# Altium schematic sheet Schema.SchDoc: SensorBoard_Schema
size A4; Date: 04.03.2021; Author: bweina; CompanyName: ICT Bbc AG; DrawnBy: bweina; Engineer: bweina; Organization: ICT Bbc AG; Revision: 1.1.0; SheetNumber: 1; SheetTotal: 1; Time: 13:55
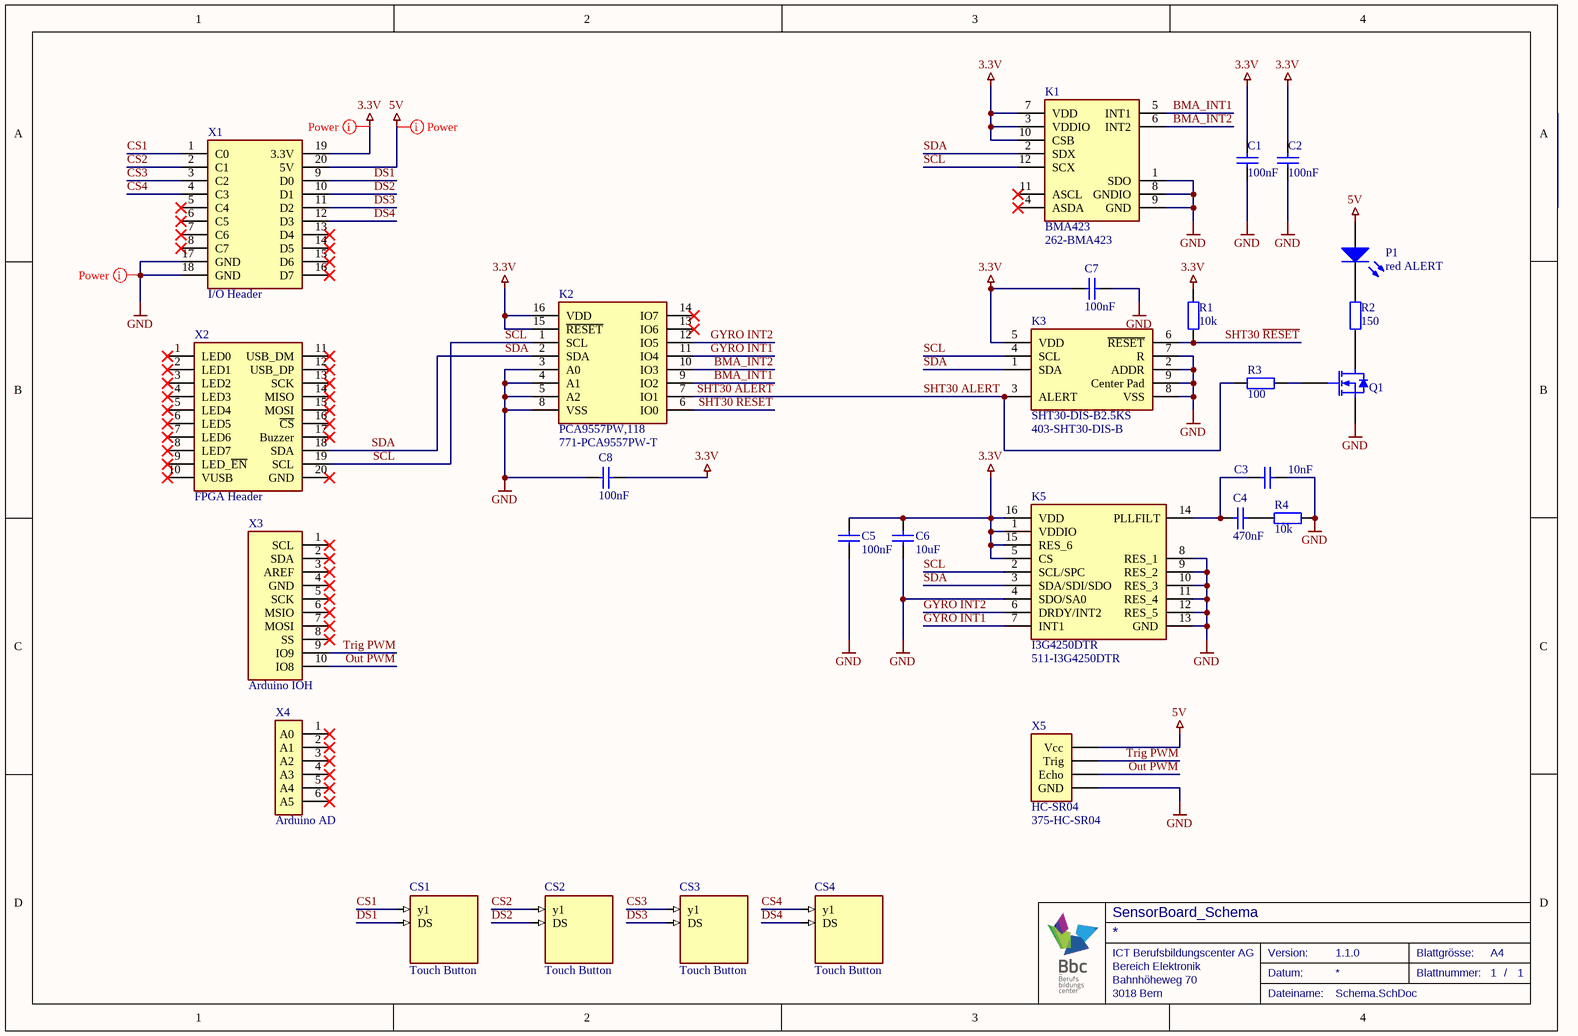
[diagram p0: Schema.SchDoc]

## Parts
C1  value 100nF  [CAP CER 0805 H]  (hidden comment: Capacitor)
C2  value 100nF  [CAP CER 0805 H]  (hidden comment: Capacitor)
C3  value 10nF  [CAP CER 0805 H]  (hidden comment: Capacitor)
C4  value 470nF  [CAP CER 0805 H]  (hidden comment: Capacitor)
C5  value 100nF  [CAP CER 0805 H]  (hidden comment: Capacitor)
C6  value 10uF  [CAP CER 0805 H]  (hidden comment: Capacitor)
C7  value 100nF  [CAP CER 0805 H]  (hidden comment: Capacitor)
C8  value 100nF  [CAP CER 0805 H]  (hidden comment: Capacitor)
CS1  Touch Button  [Button Self Rectangle]
CS2  Touch Button  [Button Self Rectangle]
CS3  Touch Button  [Button Self Rectangle]
CS4  Touch Button  [Button Self Rectangle]
K1  BMA423  Supplier Part Number 1: 262-BMA423  [BMA423]
K2  PCA9557PW,118  Supplier Part Number 1: 771-PCA9557PW-T  [SOP65P640X110-16N]
K3  SHT30-DIS-B2.5KS  Supplier Part Number 1: 403-SHT30-DIS-B  [SHT30DISB25KS]
K5  I3G4250DTR  Supplier Part Number 1: 511-I3G4250DTR  [LGA-16L(4X4X1.1MM)]
P1  red ALERT  [LED 1206 red H]
Q1  MOSFET N-Channel  [SOT96P237X111-3N]  (value not drawn)
R1  value 10k  [RES 0805 H]  (hidden comment: Resistor)
R2  value 150  [RES 0805 H]  (hidden comment: Resistor)
R3  value 100  [RES 0805 H]  (hidden comment: Resistor)
R4  value 10k  [RES 0805 H]  (hidden comment: Resistor)
X1  I/O Header  [Header THT male 2x10]
X2  FPGA Header  [Header THT male 2x10]
X3  Arduino IOH  [Header THT male 1x10]
X4  Arduino AD  [Header THT male 1x6]
X5  HC-SR04  Supplier Part Number 1: 375-HC-SR04  [HC-SR04]

## Nets
3.3V: C1.2 C2.1 C5.1 C6.1 C7.1 C8.2 K1.3(VDDIO) K1.7(VDD) K1.10(CSB) K2.15(~{RESET}) K2.16(VDD) K3.5(VDD) K5.1(VDDIO) K5.5(CS) K5.15(RES_6) K5.16(VDD) R1.2 X1.19(3.3V)
5V: P1.A(Anode) X1.20(5V) X5.1(Vcc)
GND: C1.1 C2.2 C3.2 C5.2 C6.2 C7.2 C8.1 K1.1(SDO) K1.8(GNDIO) K1.9(GND) K2.3(A0) K2.4(A1) K2.5(A2) K2.8(VSS) K3.2(ADDR) K3.7(R) K3.8(VSS) K3.9(Center_Pad) K5.4(SDO/SA0) K5.8(RES_1) K5.9(RES_2) K5.10(RES_3) K5.11(RES_4) K5.12(RES_5) K5.13(GND) Q1.2(S) R4.2 X1.17(GND) X1.18(GND) X5.4(GND)
BMA_INT1: K1.5(INT1) K2.9(IO2)
BMA_INT2: K1.6(INT2) K2.10(IO3)
CS1: CS1.y1 X1.1(C0)
CS2: CS2.y1 X1.2(C1)
CS3: CS3.y1 X1.3(C2)
CS4: CS4.y1 X1.4(C3)
DS1: CS1.DS X1.9(D0)
DS2: CS2.DS X1.10(D1)
DS3: CS3.DS X1.11(D2)
DS4: CS4.DS X1.12(D3)
GYRO INT1: K2.11(IO4) K5.7(INT1)
GYRO INT2: K2.12(IO5) K5.6(DRDY/INT2)
Out PWM: X3.10(IO8) X5.3(Echo)
SCL: K1.12(SCX) K2.1(SCL) K3.4(SCL) K5.2(SCL/SPC) X2.19(SCL)
SDA: K1.2(SDX) K2.2(SDA) K3.1(SDA) K5.3(SDA/SDI/SDO) X2.18(SDA)
SHT30 ALERT: K2.7(IO1) K3.3(ALERT) R3.1
SHT30 ~{RESET}: K2.6(IO0) K3.6(~{RESET}) R1.1
Trig PWM: X3.9(IO9) X5.2(Trig)
NetC3_1: C3.1 C4.1 K5.14(PLLFILT)
NetC4_2: C4.2 R4.1
NetP1_C: P1.C(Cathode) R2.2
NetQ1_1: Q1.1(G) R3.2
NetQ1_3: Q1.3(D) R2.1

Not connected (* = marked no-connect by the designer): K1 4(ASDA)* 11(ASCL)*; K2 13(IO6)* 14(IO7)*; X1 5(C4)* 6(C5)* 7(C6)* 8(C7)* 13(D4)* 14(D5)* 15(D6)* 16(D7)*; X2 1(LED0)* 2(LED1)* 3(LED2)* 4(LED3)* 5(LED4)* 6(LED5)* 7(LED6)* 8(LED7)* 9(LED_~{EN})* 10(VUSB)* 11(USB_DM)* 12(USB_DP)* 13(SCK)* 14(MISO)* 15(MOSI)* 16(~{CS})* 17(Buzzer)* 20(GND)*; X3 1(SCL)* 2(SDA)* 3(AREF)* 4(GND)* 5(SCK)* 6(MSIO)* 7(MOSI)* 8(SS)*; X4 1(A0)* 2(A1)* 3(A2)* 4(A3)* 5(A4)* 6(A5)*

## Layout directives
net class Power: 3.3V, 5V, GND

## Notes on the sheet
- Bahnhöheweg 70
- ICT Berufsbildungscenter AG
- Bereich Elektronik
- Datum:
- Version:
- Blattgrösse:
- Blattnummer:
- A4
- /
- 3018 Bern
- Dateiname:

## Library data of the parts
C1-C8 = Capacitor: Non polarized capacitor; LatestRevisionDate: 01.04.2019; Publisher: ICT Berufsbildungscenter AG
CS1-CS4 = Touch Button: Rechteckige Kupferfläche
K1 = Beschleunigungsmesser: Beschleunigungsmesser Triaxial low-g 12bit Acceleration Sensor; ComponentLink1Description: New link; ComponentLink1URL: https://www.mouser.ch/ProductDetail/Bosch-Sensortec/BMA423/?qs=HXFqYaX1Q2xC%252BSgeGoX3mg%3D%3D; Supplier 1: Mouser
K2 = Port Expander: Schnittstelle - I/O-Erweiterer OCT SMBUS/I2C INTRFC; ComponentLink1Description: New link; ComponentLink1URL: https://www.mouser.ch/ProductDetail/NXP-Semiconductors/PCA9557PW118?qs=LOCUfHb8d9vFRJDeZaj93A%3D%3D; Supplier 1: Mouser
K3 = Humidity & Temp. Sensor: Feuchtigkeitssensoren für Plattenmontage RH Accuracy +/- 3% Digital, DFN Type; ComponentLink1Description: New link; ComponentLink1URL: https://www.mouser.ch/ProductDetail/Sensirion/SHT30-DIS-B25kS?qs=y6ZabgHbY%252BwVK7712NFj8g==; Supplier 1: Mouser
K5 = Gyroskop: Gyroskope AUTO & INDUSTRIAL SENSORS; ComponentLink1Description: New link; ComponentLink1URL: https://www.mouser.ch/ProductDetail/STMicroelectronics/I3G4250DTR/?qs=%2Fha2pyFadugIiSRyLsysBNkcELyrugzinfnj1%2FprSe9QiJpXEwggKQ%3D%3D; Supplier 1: Mouser
P1 = LED: Light emitting diode; LatestRevisionDate: 03.04.2019; Publisher: ICT Berufsbildungscenter AG
X1 = I/O Header: board to board header; LatestRevisionDate: 02.05.2019; Publisher: ICT Berufsbildungscenter AG
X2 = FPGA Header: board to board header; LatestRevisionDate: 02.05.2019; Publisher: ICT Berufsbildungscenter AG
X3 = Arduino IOH: board to board header; LatestRevisionDate: 02.05.2019; Publisher: ICT Berufsbildungscenter AG
X4 = Arduino AD: board to board header; LatestRevisionDate: 02.05.2019; Publisher: ICT Berufsbildungscenter AG
X5 = Ultraschall-Distanzsensor: Buchsenanschluss für den Sensor; ComponentLink1Description: New link; ComponentLink1URL: https://www.mouser.ch/ProductDetail/OSEPP-Electronics/HC-SR04/?qs=%2Fha2pyFaduh4%252Bb8VhcwOUSciFhLRlhNOu8G0etmXCiZdsBFkrSGdCA%3D%3D; Supplier 1: Mouser
R1-R4 = Resistor: LatestRevisionDate: 02.04.2019; Publisher: ICT Berufsbildungscenter AG